# Altium schematic sheet IO and MCU.SchDoc: IO and MCU Section
size A4; DrawnBy: Avishka C. Herath; DocumentNumber: EN2160 #2; Revision: 1.12; SheetNumber: 2; SheetTotal: 3; Index Number: 200212F; Project: RFID Access Control System; ENG_APP_DATE: --/--/--; DSN_APP_DATE: --/--/--; CHK_APP_DATE: --/--/--
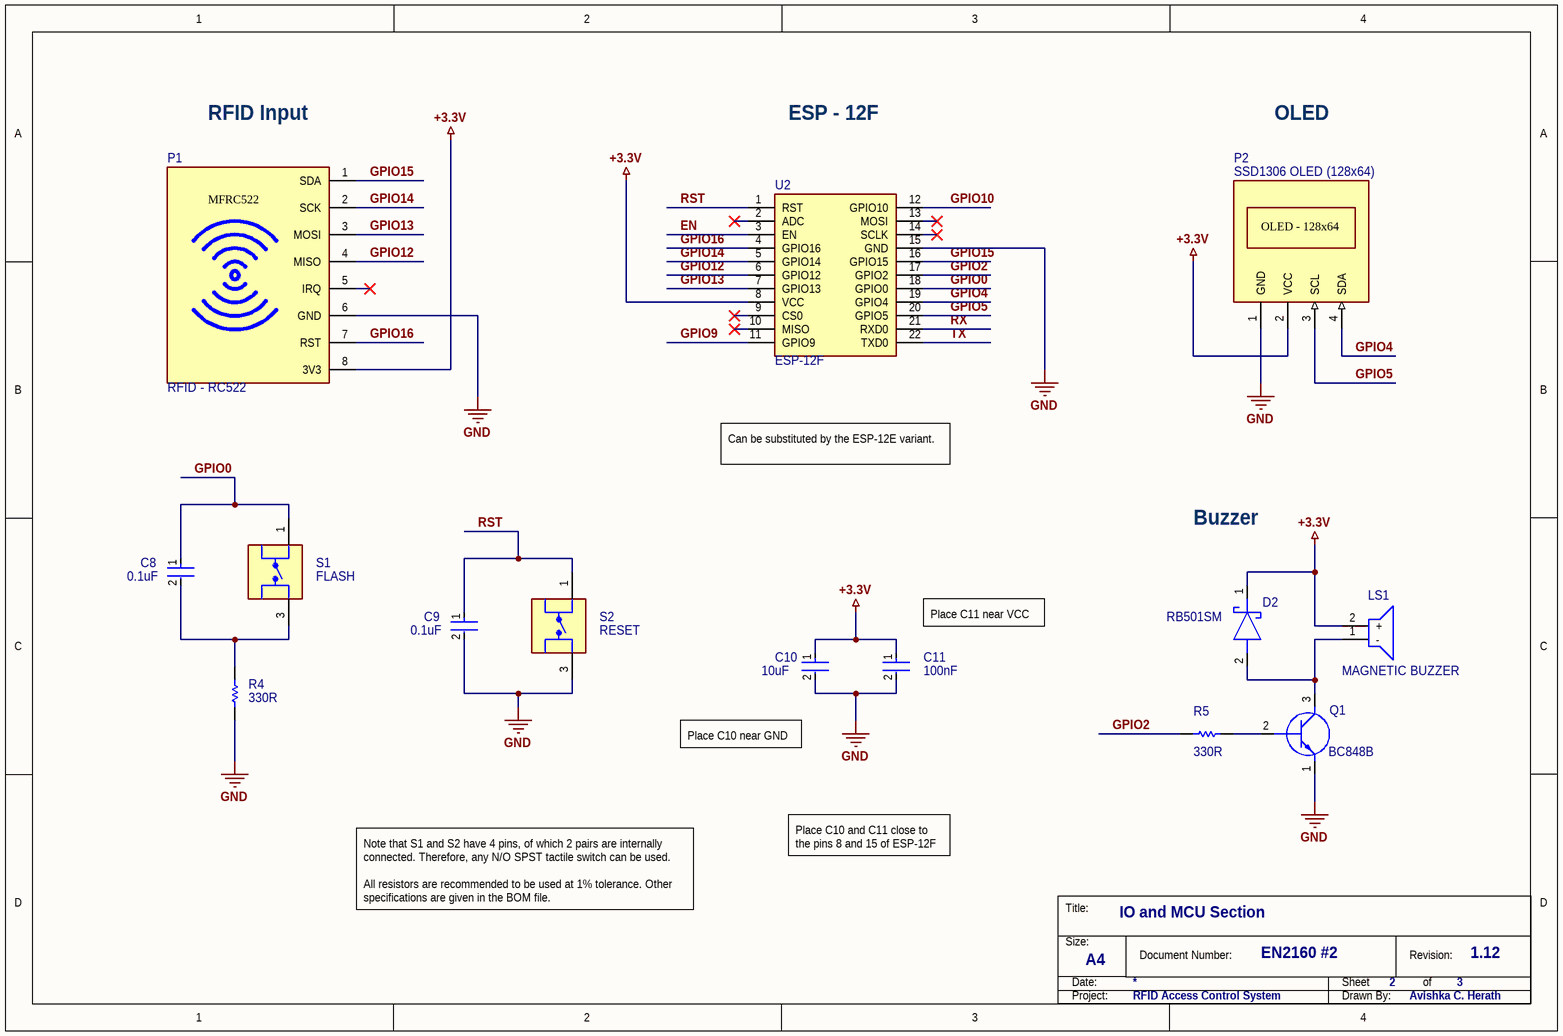
[diagram p0: IO and MCU.SchDoc]

## Parts
C8  0.1uF  [FP-CL10-0_1-MFG]
C9  0.1uF  [FP-CL10-0_1-MFG]
C10  10uF  [FP-CL21-IPC_B]
C11  100nF  [FP-CL10-0_1-MFG]
D2  RB501SM  [RB501SM30FHT2R]
LS1  MAGNETIC BUZZER  [CMI1295IC0385T]
P1  RFID - RC522  [RFID - RC522-Footprint-1]
P2  SSD1306 OLED (128x64)  [SSD1306 OLED (128x64)-Footprint-1]
Q1  BC848B  [SOT95P240X120-3N]
R4  330R  [RESC2013X60X35ML10T20]
R5  330R  [RESC2013X60X35ML10T20]
S1  FLASH  [SW_PTS525SM15SMTR2LFS]
S2  RESET  [SW_PTS525SM15SMTR2LFS]
U2  ESP-12F  [esp12f]

## Nets
+3.3V: C10.1 C11.1 D2.1(K) LS1.2(+) P1.8(3V3) P2.2(VCC) U2.8(VCC)
GND: C9.2 C10.2 C11.2 P1.6(GND) P2.1(GND) Q1.1(E) R4.2 S2.3 U2.15(GND)
EN: U2.3(EN)
GPIO0: C8.1 S1.1 U2.18(GPIO0)
GPIO2: R5.1 U2.17(GPIO2)
GPIO4: P2.4(SDA) U2.19(GPIO4)
GPIO5: P2.3(SCL) U2.20(GPIO5)
GPIO9: U2.11(GPIO9)
GPIO10: U2.12(GPIO10)
GPIO12: P1.4(MISO) U2.6(GPIO12)
GPIO13: P1.3(MOSI) U2.7(GPIO13)
GPIO14: P1.2(SCK) U2.5(GPIO14)
GPIO15: P1.1(SDA) U2.16(GPIO15)
GPIO16: P1.7(RST) U2.4(GPIO16)
RST: C9.1 S2.1 U2.1(RST)
RX: U2.21(RXD0)
TX: U2.22(TXD0)
NetC8_2: C8.2 R4.1 S1.3
NetD2_2: D2.2(A) LS1.1(-) Q1.3(C)
NetQ1_2: Q1.2(B) R5.2

Not connected (* = marked no-connect by the designer): P1 5(IRQ)*; S1 2 4; S2 2 4; U2 2(ADC)* 9(CS0)* 10(MISO)* 13(MOSI)* 14(SCLK)*

## Notes on the sheet
- RFID Input
- ESP - 12F
- OLED
- Can be substituted by the ESP-12E variant.
- Buzzer
- (near C11) Place C11 near VCC
- (near C10) Place C10 near GND
- Place C10 and C11 close to the pins 8 and 15 of ESP-12F in PCB.
- Note that S1 and S2 have 4 pins, of which 2 pairs are internally connected. Therefore, any N/O SPST tactile switch can be used.
  All resistors are recommended to be used at 1% tolerance. Other specifications are given in the BOM file.
- Title:
- Size:
- Date:
- A4
- Document Number:
- Sheet
- Revision:
- of
- Project:
- Drawn By:
- (in symbol CMP-00026-00001-2) OLED - 128x64

## Library data of the parts
C8 C9 = CMP-13271-000011-1: CAP CER 0.1UF 50V X7R 0603; Manufacturer: Samsung Electro-Mechanics America, Inc; Manufacturer Part Number: CL10B104JB8NNNC; Value: 100nF; Material: Ceramic; Temperature Coefficient: 15%; Tolerance: 5%; Ipc Land Pattern Name: CAPC16080X80; Device Class L1: Passive Components; Digikey Description: CAP CER 0.1UF 50V X7R 0603; Voltage Rating: 50V; Height: 0.9mm; ComponentLink2Description: Datasheet; Device Class L2: Capacitors; ComponentLink2URL: http://www.samsungsem.com/kr/support/product-search/mlcc/__icsFiles/afieldfile/2019/06/18/CL10B104JB8NNNC-19.pdf; Temperature Characteristic: X7R; Temperature Range High: +125°C; Lead Free: Yes; Temperature Range Low: -55°C; Category: Cap; Package: CL10-0.1; Temperature: -55°C to +125°C; Octopart: https://octopart.com/cl10b104jb8nnnc-samsung-9302151; Device Class L3: Ceramic Capacitors; RoHS: TRUE; Automotive: No; Capacitance: 100nF
C10 = CMP-2000-06102-2: CL21 Series 0805 10uF 16V ±10% Tolerance X5R Multilayer Ceramic Chip Capacitor; Dielectric: X7R; Length: 2mm; Depth: 1.25mm; Voltage: 16V; Width: 0.049inch; Capacitance: 10uF; Lead Free: Lead Free; Max Operating Temperature: 85°C; Mount: Surface Mount; Voltage Rating: 16V; Height: 1.25mm; Radiation Hardening: No; Packaging: Tape and Reel; Voltage Rating (DC): 16V; Thickness: 0.055inch; Case/Package: 0805; Case Code (Imperial): 0805; Min Operating Temperature: -55°C; Case Code (Metric): 2012; Package Quantity: 1; Tolerance: 10%
C11 = CMP-13271-000011-1: CAP CER 0.1UF 50V X7R 0603; Manufacturer: Samsung Electro-Mechanics America, Inc; Manufacturer Part Number: CL10B104JB8NNNC; Material: Ceramic; Temperature Coefficient: 15%; Tolerance: 5%; Ipc Land Pattern Name: CAPC16080X80; Device Class L1: Passive Components; Digikey Description: CAP CER 0.1UF 50V X7R 0603; Voltage Rating: 50V; Height: 0.9mm; ComponentLink2Description: Datasheet; Device Class L2: Capacitors; ComponentLink2URL: http://www.samsungsem.com/kr/support/product-search/mlcc/__icsFiles/afieldfile/2019/06/18/CL10B104JB8NNNC-19.pdf; Temperature Characteristic: X7R; Value: 100nF; Temperature Range High: +125°C; Lead Free: Yes; Temperature Range Low: -55°C; Category: Cap; Package: CL10-0.1; Temperature: -55°C to +125°C; Octopart: https://octopart.com/cl10b104jb8nnnc-samsung-9302151; Device Class L3: Ceramic Capacitors; RoHS: TRUE; Automotive: No; Capacitance: 100nF
D2 = RB501SM-30FHT2R: Schottky Diode; Manufacturer_Name: ROHM Semiconductor; Datasheet Link: https://fscdn.rohm.com/en/products/databook/datasheet/discrete/diode/schottky_barrier/rb501sm-30fht2r-e.pdf; Height: 0.6mm; Manufacturer_Part_Number: RB501SM-30FHT2R; Mouser Part Number: 755-RB501SM-30FHT2R; Mouser Price/Stock: https://www.mouser.co.uk/ProductDetail/ROHM-Semiconductor/RB501SM-30FHT2R?qs=4v%252BiZTmLVHEIefGC27iswg%3D%3D
LS1 = CMI-1295IC-0385T: Loudspeaker or Buzzer; Manufacturer_Name: CUI Devices; Datasheet Link: https://www.arrow.com/en/products/cmi-1295ic-0385t/cui-devices; Height: 9.7mm; Manufacturer_Part_Number: CMI-1295IC-0385T; Mouser Part Number: 490-CMI-1295IC-0385T; Mouser Price/Stock: https://www.mouser.co.uk/ProductDetail/CUI-Devices/CMI-1295IC-0385T?qs=OlC7AqGiEDk2g42uzfEhlg%3D%3D; Arrow Part Number: CMI-1295IC-0385T; Arrow Price/Stock: https://www.arrow.com/en/products/cmi-1295ic-0385t/cui-devices?region=nac
P1 = CMP-00025-00003-1: A 13.56MHz RF reader module, which use the RC522 IC, plus 2 S50 RFID cards to help you learn and add the 13.56 MHz RF transition to your project.; IC: MFRC522; Interface: I2C,SPI,UART; Operating Frequency: 13.56 MHz; Dimensions: 40mm×60mm
P2 = CMP-00026-00001-2: The OLED display module is a small 0.96" diagonal display made of individual blue OLED pixels that can be turned on or off by the controller chip. It does not require a backlight and is compatible with I2C communication through the SSD1306 driver chip.; Number of Pixels: 128 × 64; Size: 0.96"; Interface: I2C; Dimension: 27.8 x27.3x 4.3 mm
Q1 = BC848BHZGT116: Transistor BJT NPN; Manufacturer_Name: ROHM Semiconductor; Datasheet Link: https://componentsearchengine.com/Datasheets/2/BC848BHZGT116.pdf; Height: 1.2mm; Manufacturer_Part_Number: BC848BHZGT116; Mouser Part Number: 755-BC848BHZGT116; Mouser Price/Stock: https://www.mouser.co.uk/ProductDetail/ROHM-Semiconductor/BC848BHZGT116?qs=zGux8KhMp6JnZZvroKxywg%3D%3D
R4 R5 = CMP-009-00179-1: Res Thick Film 0805 330R Ohm 1% 0.125W(1/8W) +/-100ppm/C Epoxy Pad SMD T/R
S1 S2 = CMP-035-000000-1: Tactile Switch SPST-NO Top Actuated Surface Mount; MP: PTS525SM15SMTR2 LFS; MF: C&K; Purchase-URL: https://pricing.snapeda.com/search/part/PTS525SM15SMTR2 LFS/?ref=eda; Value: *; Component Type: Standard; Check_prices: https://www.snapeda.com/parts/PTS525SM15SMTR2%20LFS/C%2526K/view-part/?ref=eda; SnapEDA_Link: https://www.snapeda.com/parts/PTS525SM15SMTR2%20LFS/C%2526K/view-part/?ref=snap; Design Item ID: PTS525SM15SMTR2LFS; Pin Count: 4; Source: PTS525SM15SMTR2LFS.SchLib; Price: None; Availability: In Stock; Package: Tactile Switch CK
U2 = ESP-12F: Integrated Circuit; Manufacturer_Name: Ai-Thinker; Datasheet Link: https://docs.ai-thinker.com/_media/esp8266/docs/esp-12f_product_specification_en.pdf; Height: 3.1mm; Manufacturer_Part_Number: ESP-12F